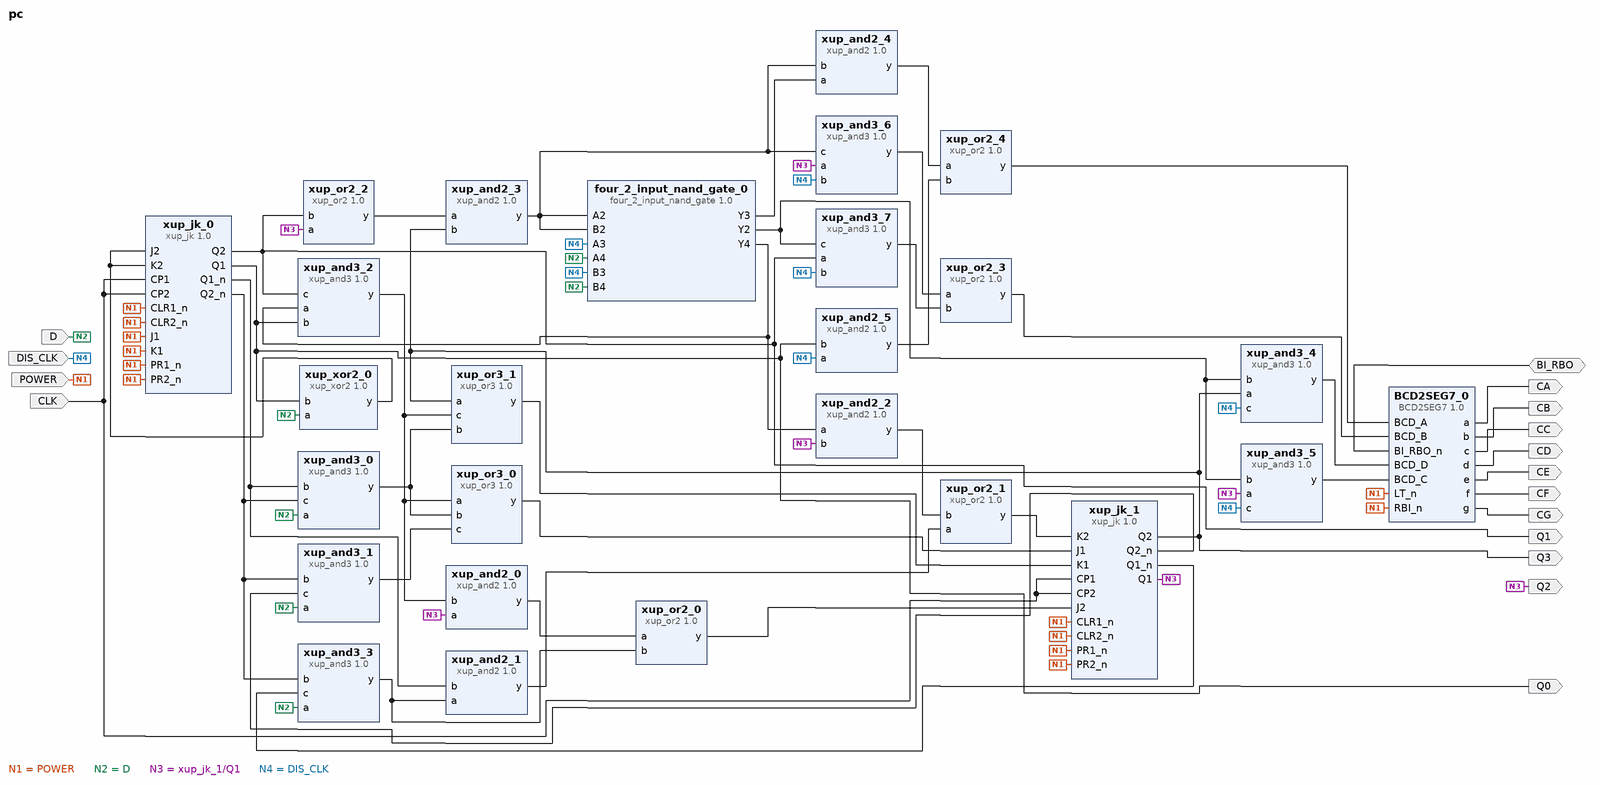
[diagram p0: block diagram of the top level]
# Vivado block design pc, Vivado 2014.2
create_bd_design pc

create_bd_port -dir I CLK
create_bd_port -dir I POWER
create_bd_port -dir I D
create_bd_port -dir O Q0
create_bd_port -dir O Q1
create_bd_port -dir O Q3
create_bd_port -dir O Q2
create_bd_port -dir I DIS_CLK
create_bd_port -dir O CA
create_bd_port -dir O CB
create_bd_port -dir O CC
create_bd_port -dir O CD
create_bd_port -dir O CE
create_bd_port -dir O CF
create_bd_port -dir O CG
create_bd_port -dir IO BI_RBO

create_bd_cell -type ip -vlnv sysu:user:xup_jk:1.0 xup_jk_0
create_bd_cell -type ip -vlnv xilinx.com:xup:xup_xor2:1.0 xup_xor2_0
create_bd_cell -type ip -vlnv xilinx.com:xup:xup_and3:1.0 xup_and3_0
create_bd_cell -type ip -vlnv sysu:user:xup_jk:1.0 xup_jk_1
create_bd_cell -type ip -vlnv xilinx.com:xup:xup_and3:1.0 xup_and3_1
create_bd_cell -type ip -vlnv xilinx.com:xup:xup_and3:1.0 xup_and3_2
create_bd_cell -type ip -vlnv xilinx.com:XUP:four_2_input_nand_gate:1.0 four_2_input_nand_gate_0
create_bd_cell -type ip -vlnv xilinx.com:xup:xup_or3:1.0 xup_or3_0
create_bd_cell -type ip -vlnv xilinx.com:xup:xup_or3:1.0 xup_or3_1
create_bd_cell -type ip -vlnv xilinx.com:xup:xup_and3:1.0 xup_and3_3
create_bd_cell -type ip -vlnv xilinx.com:xup:xup_and2:1.0 xup_and2_0
create_bd_cell -type ip -vlnv xilinx.com:xup:xup_or2:1.0 xup_or2_0
create_bd_cell -type ip -vlnv xilinx.com:xup:xup_and2:1.0 xup_and2_1
create_bd_cell -type ip -vlnv xilinx.com:xup:xup_or2:1.0 xup_or2_1
create_bd_cell -type ip -vlnv xilinx.com:xup:xup_and2:1.0 xup_and2_2
create_bd_cell -type ip -vlnv xilinx.com:xup:xup_or2:1.0 xup_or2_2
create_bd_cell -type ip -vlnv xilinx.com:xup:xup_and2:1.0 xup_and2_3
create_bd_cell -type ip -vlnv xilinx.com:xup:xup_and3:1.0 xup_and3_4
create_bd_cell -type ip -vlnv xilinx.com:xup:xup_and3:1.0 xup_and3_5
create_bd_cell -type ip -vlnv xilinx.com:xup:xup_and3:1.0 xup_and3_6
create_bd_cell -type ip -vlnv xilinx.com:xup:xup_and3:1.0 xup_and3_7
create_bd_cell -type ip -vlnv xilinx.com:xup:xup_or2:1.0 xup_or2_3
create_bd_cell -type ip -vlnv xilinx.com:xup:xup_and2:1.0 xup_and2_4
create_bd_cell -type ip -vlnv xilinx.com:xup:xup_and2:1.0 xup_and2_5
create_bd_cell -type ip -vlnv xilinx.com:xup:xup_or2:1.0 xup_or2_4
create_bd_cell -type ip -vlnv xilinx.com:xup:BCD2SEG7:1.0 BCD2SEG7_0

# ---- connections ----

connect_bd_net [get_bd_ports CLK] [get_bd_pins xup_jk_0/CP1] [get_bd_pins xup_jk_0/CP2] [get_bd_pins xup_jk_1/CP2] [get_bd_pins xup_jk_1/CP1]
connect_bd_net [get_bd_ports POWER] \
  [get_bd_pins xup_jk_0/J1] [get_bd_pins xup_jk_0/K1] [get_bd_pins xup_jk_0/CLR1_n] [get_bd_pins xup_jk_0/CLR2_n] \
  [get_bd_pins xup_jk_0/PR1_n] [get_bd_pins xup_jk_0/PR2_n] [get_bd_pins xup_jk_1/PR2_n] [get_bd_pins xup_jk_1/PR1_n] \
  [get_bd_pins xup_jk_1/CLR2_n] [get_bd_pins xup_jk_1/CLR1_n] [get_bd_pins BCD2SEG7_0/LT_n] [get_bd_pins BCD2SEG7_0/RBI_n]
connect_bd_net [get_bd_ports D] \
  [get_bd_pins xup_xor2_0/a] [get_bd_pins xup_and3_0/a] [get_bd_pins xup_and3_1/a] [get_bd_pins four_2_input_nand_gate_0/A4] \
  [get_bd_pins four_2_input_nand_gate_0/B4] [get_bd_pins xup_and3_3/a]
connect_bd_net [get_bd_pins xup_jk_0/Q1] [get_bd_ports Q0] [get_bd_pins xup_xor2_0/b] [get_bd_pins xup_and3_2/b] [get_bd_pins xup_and2_5/b]
connect_bd_net [get_bd_pins xup_xor2_0/y] [get_bd_pins xup_jk_0/J2] [get_bd_pins xup_jk_0/K2]
connect_bd_net [get_bd_pins xup_jk_0/Q1_n] [get_bd_pins xup_and3_0/b] [get_bd_pins xup_and2_1/b]
connect_bd_net [get_bd_pins xup_jk_0/Q2_n] [get_bd_pins xup_and3_0/c] [get_bd_pins xup_and3_1/b] [get_bd_pins xup_and3_3/b]
connect_bd_net [get_bd_pins xup_jk_1/Q2_n] [get_bd_pins xup_and3_1/c]
connect_bd_net [get_bd_pins four_2_input_nand_gate_0/Y4] [get_bd_pins xup_and3_2/a] [get_bd_pins xup_and2_2/a]
connect_bd_net [get_bd_pins xup_jk_0/Q2] [get_bd_ports Q1] [get_bd_pins xup_and3_2/c] [get_bd_pins xup_or2_2/b] [get_bd_pins xup_and3_7/a]
connect_bd_net [get_bd_pins xup_and3_2/y] [get_bd_pins xup_or3_0/a] [get_bd_pins xup_or3_1/c] [get_bd_pins xup_and2_0/b]
connect_bd_net [get_bd_pins xup_and3_0/y] [get_bd_pins xup_or3_0/b] [get_bd_pins xup_or3_1/b]
connect_bd_net [get_bd_pins xup_and3_1/y] [get_bd_pins xup_or3_0/c]
connect_bd_net [get_bd_pins xup_or3_0/y] [get_bd_pins xup_jk_1/J1]
connect_bd_net [get_bd_pins xup_jk_1/Q2] [get_bd_ports Q3] [get_bd_pins xup_or3_1/a] [get_bd_pins xup_and2_3/b] [get_bd_pins xup_and3_4/a]
connect_bd_net [get_bd_pins xup_or3_1/y] [get_bd_pins xup_jk_1/K1]
connect_bd_net [get_bd_pins xup_jk_1/Q1_n] [get_bd_pins xup_and3_3/c]
connect_bd_net [get_bd_pins xup_jk_1/Q1] \
  [get_bd_ports Q2] [get_bd_pins xup_and2_0/a] [get_bd_pins xup_and2_2/b] [get_bd_pins xup_or2_2/a] \
  [get_bd_pins xup_and3_5/a] [get_bd_pins xup_and3_6/a]
connect_bd_net [get_bd_pins xup_and2_0/y] [get_bd_pins xup_or2_0/a]
connect_bd_net [get_bd_pins xup_and3_3/y] [get_bd_pins xup_or2_0/b] [get_bd_pins xup_and2_1/a]
connect_bd_net [get_bd_pins xup_or2_0/y] [get_bd_pins xup_jk_1/J2]
connect_bd_net [get_bd_pins xup_and2_1/y] [get_bd_pins xup_or2_1/a]
connect_bd_net [get_bd_pins xup_or2_1/y] [get_bd_pins xup_jk_1/K2]
connect_bd_net [get_bd_pins xup_and2_2/y] [get_bd_pins xup_or2_1/b]
connect_bd_net [get_bd_ports DIS_CLK] \
  [get_bd_pins four_2_input_nand_gate_0/A3] [get_bd_pins four_2_input_nand_gate_0/B3] [get_bd_pins xup_and3_4/c] \
  [get_bd_pins xup_and3_5/c] [get_bd_pins xup_and3_6/b] [get_bd_pins xup_and3_7/b] [get_bd_pins xup_and2_5/a]
connect_bd_net -net xup_or2_2_y [get_bd_pins xup_and2_3/y] \
  [get_bd_pins four_2_input_nand_gate_0/B2] [get_bd_pins four_2_input_nand_gate_0/A2] [get_bd_pins xup_and3_6/c] \
  [get_bd_pins xup_and2_4/b]
connect_bd_net [get_bd_pins xup_or2_2/y] [get_bd_pins xup_and2_3/a]
connect_bd_net [get_bd_pins four_2_input_nand_gate_0/Y2] [get_bd_pins xup_and3_4/b] [get_bd_pins xup_and3_5/b] [get_bd_pins xup_and3_7/c]
connect_bd_net [get_bd_pins xup_and3_4/y] [get_bd_pins BCD2SEG7_0/BCD_D]
connect_bd_net [get_bd_pins xup_and3_5/y] [get_bd_pins BCD2SEG7_0/BCD_C]
connect_bd_net [get_bd_pins xup_and3_6/y] [get_bd_pins xup_or2_3/a]
connect_bd_net [get_bd_pins xup_and3_7/y] [get_bd_pins xup_or2_3/b]
connect_bd_net [get_bd_pins xup_or2_3/y] [get_bd_pins BCD2SEG7_0/BCD_B]
connect_bd_net [get_bd_pins four_2_input_nand_gate_0/Y3] [get_bd_pins xup_and2_4/a]
connect_bd_net [get_bd_pins xup_and2_4/y] [get_bd_pins xup_or2_4/a]
connect_bd_net [get_bd_pins xup_and2_5/y] [get_bd_pins xup_or2_4/b]
connect_bd_net [get_bd_pins xup_or2_4/y] [get_bd_pins BCD2SEG7_0/BCD_A]
connect_bd_net [get_bd_pins BCD2SEG7_0/a] [get_bd_ports CA]
connect_bd_net [get_bd_pins BCD2SEG7_0/b] [get_bd_ports CB]
connect_bd_net [get_bd_pins BCD2SEG7_0/c] [get_bd_ports CC]
connect_bd_net [get_bd_pins BCD2SEG7_0/d] [get_bd_ports CD]
connect_bd_net [get_bd_pins BCD2SEG7_0/e] [get_bd_ports CE]
connect_bd_net [get_bd_pins BCD2SEG7_0/f] [get_bd_ports CF]
connect_bd_net [get_bd_pins BCD2SEG7_0/g] [get_bd_ports CG]
connect_bd_net [get_bd_ports BI_RBO] [get_bd_pins BCD2SEG7_0/BI_RBO_n]

validate_bd_design
save_bd_design
